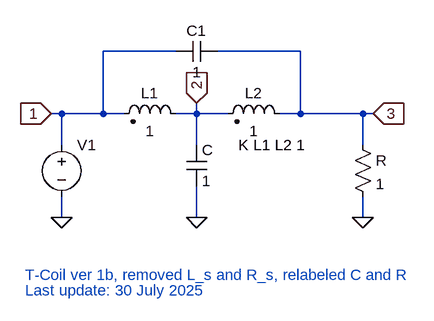
[diagram p0: schematic T-Coil-ver1b.asc]
T-Coil-ver1b.asc, the LTspice schematic file:
Version 4
SHEET 1 924 680
WIRE 320 -96 208 -96
WIRE 512 -96 384 -96
WIRE 144 0 128 0
WIRE 208 0 208 -96
WIRE 208 0 144 0
WIRE 240 0 208 0
WIRE 352 0 352 -16
WIRE 352 0 320 0
WIRE 400 0 352 0
WIRE 512 0 512 -96
WIRE 512 0 480 0
WIRE 608 0 512 0
WIRE 624 0 608 0
WIRE 144 48 144 0
WIRE 352 48 352 0
WIRE 608 48 608 0
WIRE 144 160 144 128
WIRE 352 160 352 112
WIRE 608 160 608 128
FLAG 144 160 0
FLAG 352 160 0
FLAG 608 160 0
FLAG 128 0 1
IOPIN 128 0 In
FLAG 352 -16 2
IOPIN 352 -16 In
FLAG 624 0 3
IOPIN 624 0 In
SYMBOL voltage 144 32 R0
WINDOW 3 24 96 Invisible 2
WINDOW 123 0 0 Left 0
WINDOW 39 0 0 Left 0
SYMATTR Value 1
SYMATTR InstName V1
SYMBOL ind2 336 16 M270
WINDOW 0 32 56 VTop 2
WINDOW 3 5 56 VBottom 2
SYMATTR InstName L1
SYMATTR Value 1
SYMATTR Type ind
SYMBOL ind2 496 16 M270
WINDOW 0 32 56 VTop 2
WINDOW 3 5 56 VBottom 2
SYMATTR InstName L2
SYMATTR Value 1
SYMATTR Type ind
SYMBOL cap 336 48 R0
SYMATTR InstName C
SYMATTR Value 1
SYMBOL cap 384 -112 R90
WINDOW 0 0 32 VBottom 2
WINDOW 3 32 32 VTop 2
SYMATTR InstName C1
SYMATTR Value 1
SYMBOL res 592 32 R0
SYMATTR InstName R
SYMATTR Value 1
TEXT 416 48 Left 2 !K L1 L2 1
TEXT 88 248 Left 2 ;T-Coil ver 1b, removed L_s and R_s, relabeled C and R
TEXT 88 272 Left 2 ;Last update: 30 July 2025

The netlist it stands for:
* T-Coil-ver1b.asc
V1 1 0 1
L1 2 1 1
L2 3 2 1
C 2 0 1
C1 3 1 1
R 3 0 1
K L1 L2 1
* T-Coil ver 1b, removed L_s and R_s, relabeled C and R
* Last update: 30 July 2025
.backanno
.end